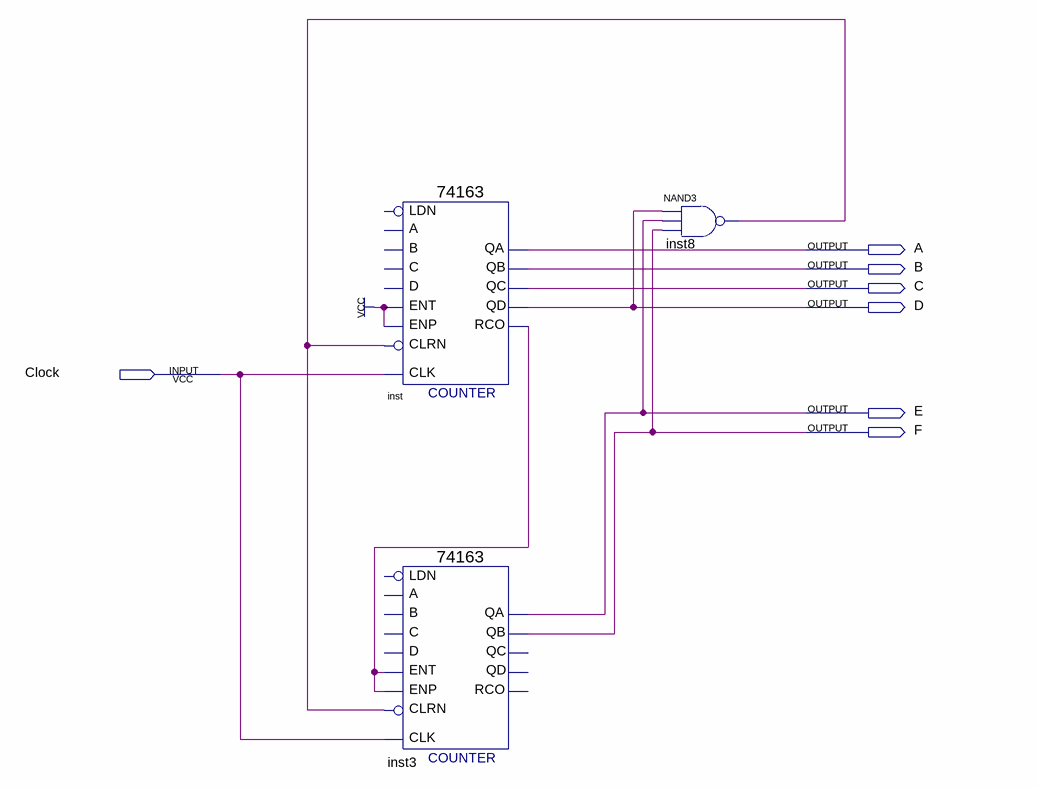
[diagram p0: schematic sheet]
// Quartus schematic 3reset.bdf as structural Verilog: 3 symbols, 7 pins
module \3reset  (
  input  Clock,
  output A,
  output B,
  output C,
  output D,
  output E,
  output F
);

  wire inst8_out, inst_rco;

  \74163  inst (
    .ENT(1'b1), .CLRN(inst8_out), .CLK(Clock), .ENP(1'b1), .QA(A), .QB(B), .QC(C), .QD(D), .RCO(inst_rco));  // open: C, B, A, D, LDN
  \74163  inst3 (
    .ENT(inst_rco), .CLRN(inst8_out), .CLK(Clock), .ENP(inst_rco), .QA(E), .QB(F));  // open: C, B, A, D, LDN, QC, QD, RCO
  nand inst8 (inst8_out, D, E, F);
endmodule
